# Altium schematic sheet 37.SchDoc
size 513 x 386 mm
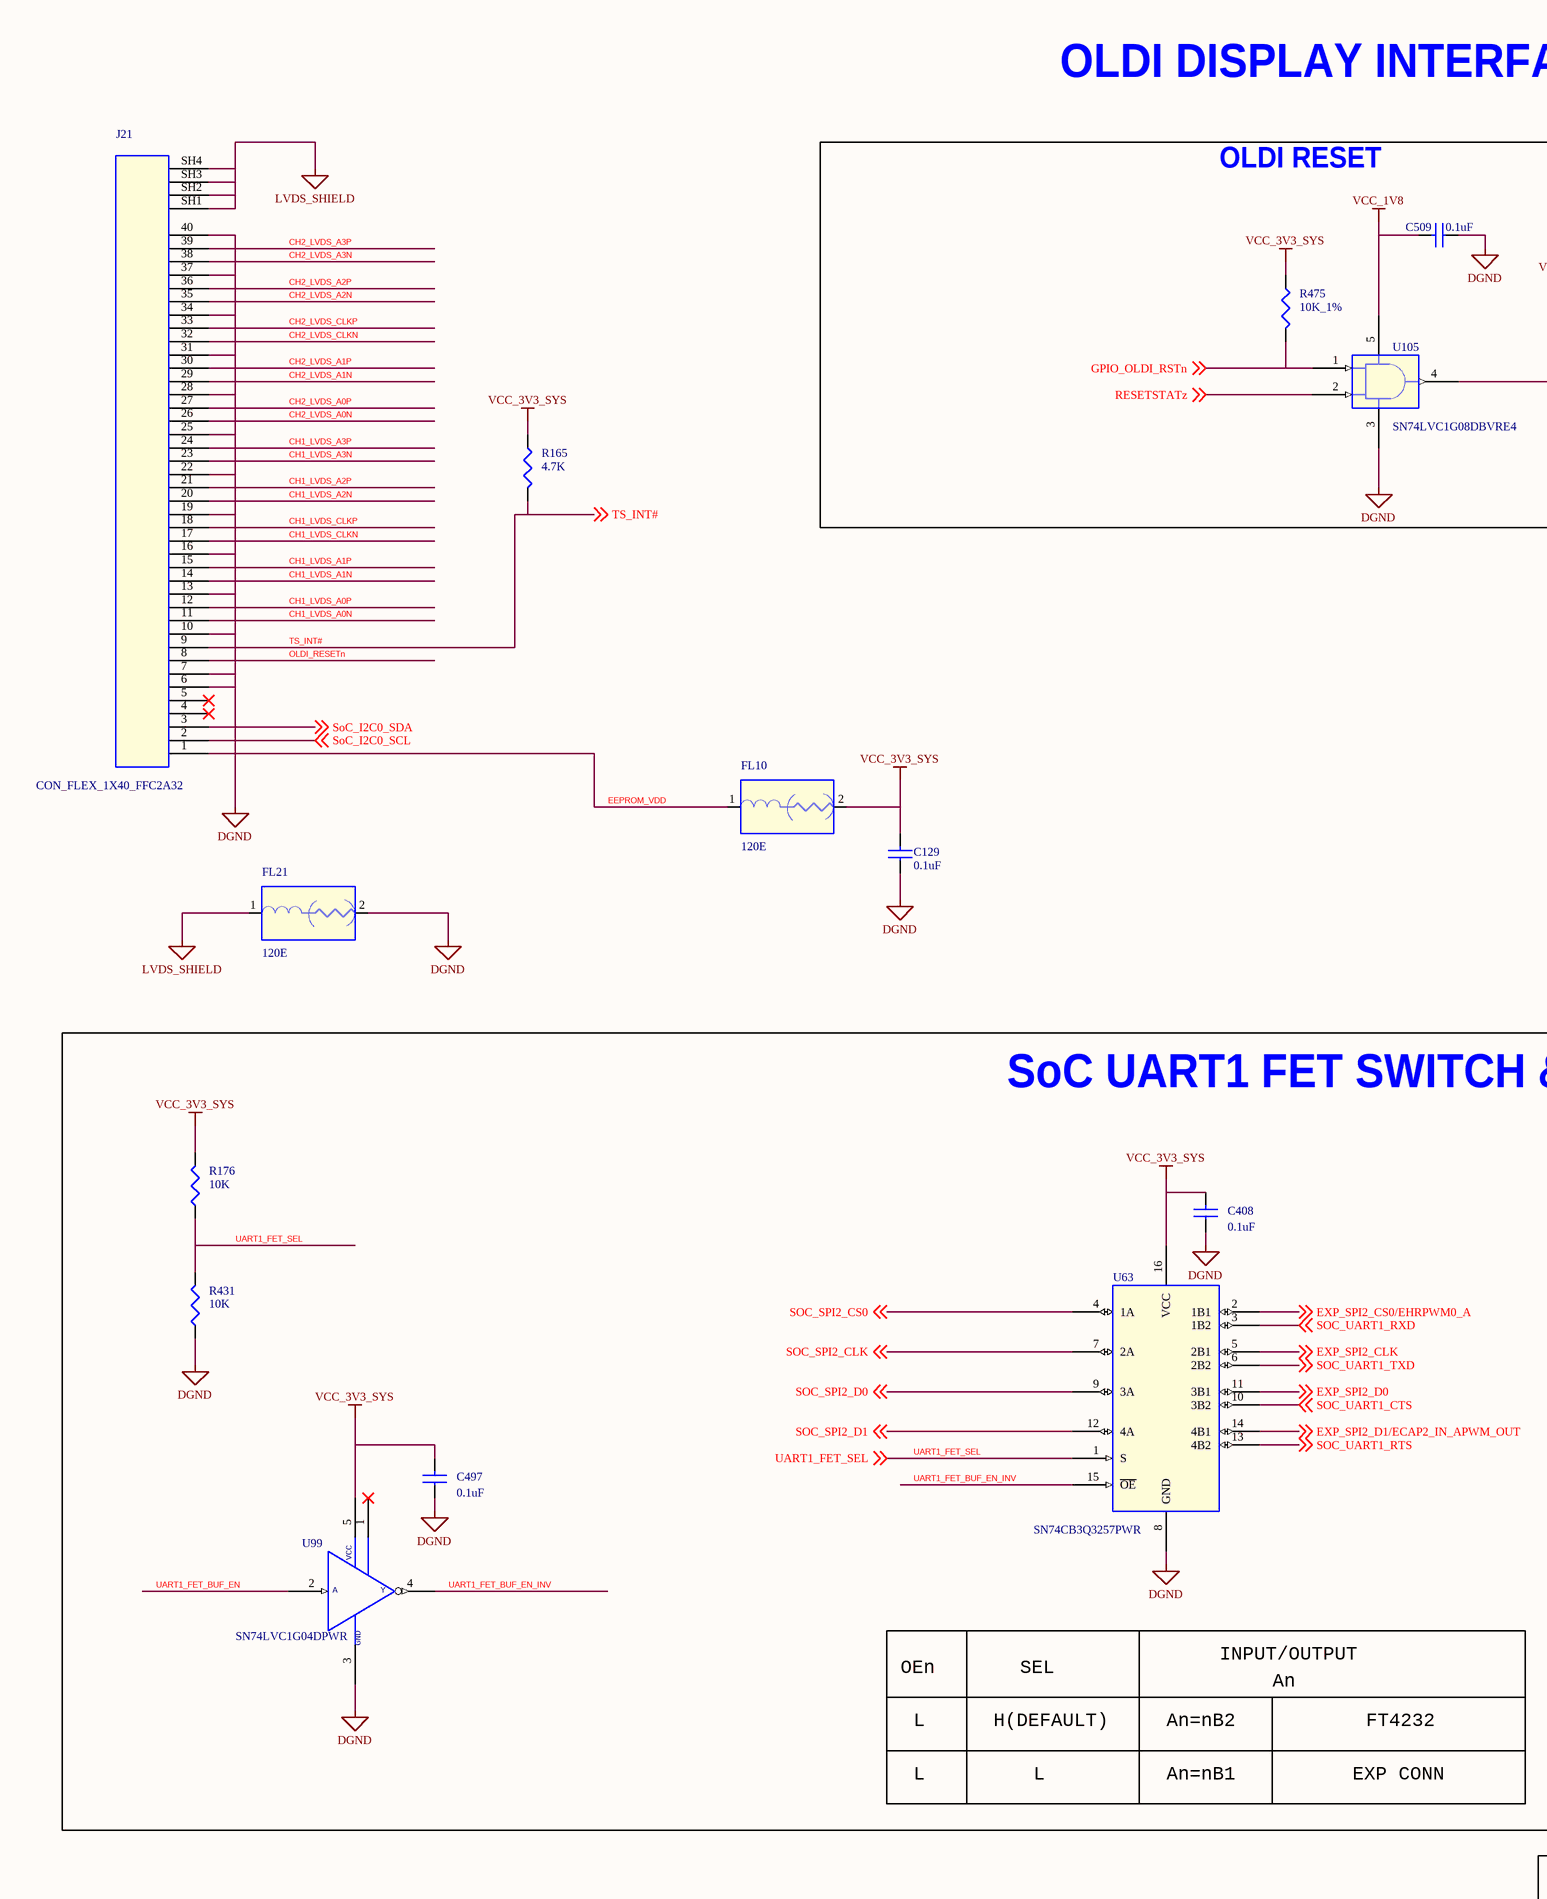
[diagram p0: 37.SchDoc, left]
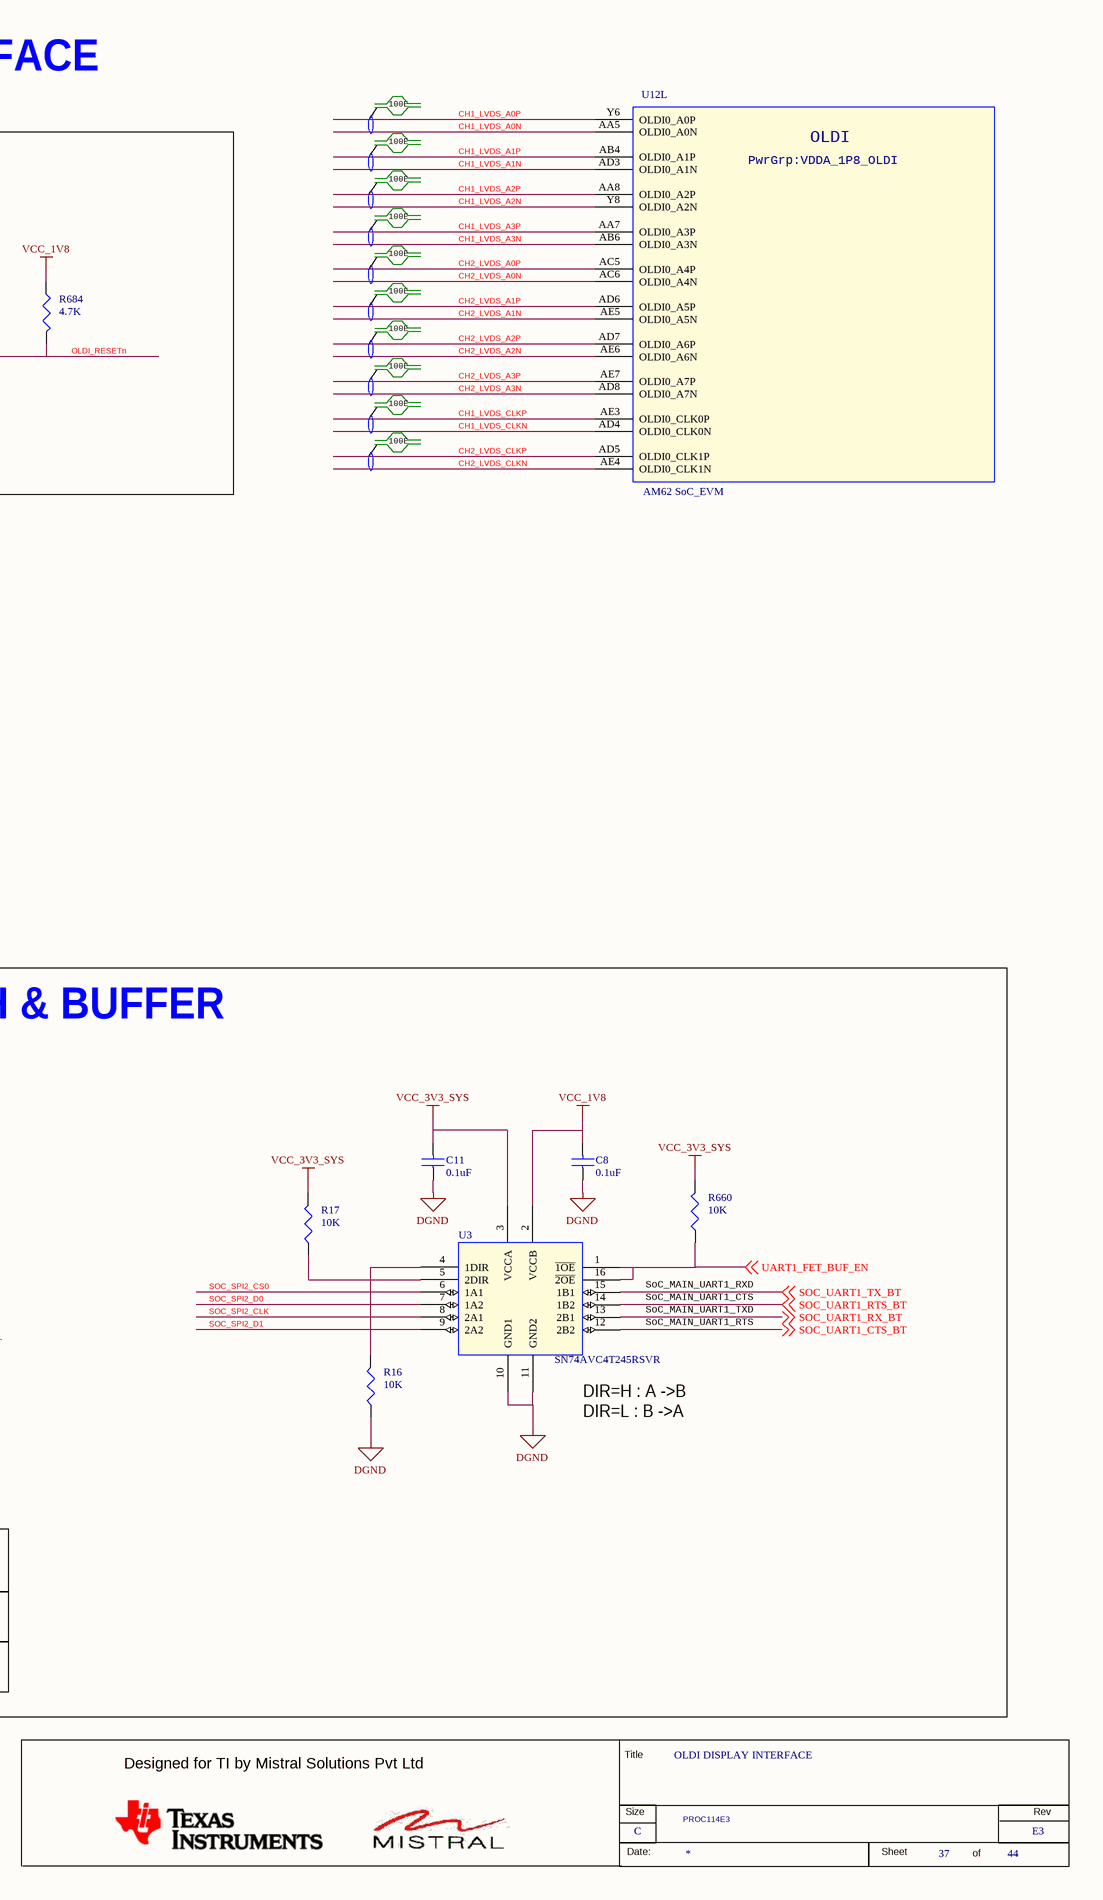
[diagram p1: 37.SchDoc, right]

## Parts
*  RevCode: E3  Title: OLDI DISPLAY INTERFACE  Page Size: C  Page Number: 37  Page Count: 44  Variant Name: PROC114E3  (hidden comment: MISTRAL_TITLEBLK_CSIZE)  (graphical)
C8  0.1uF  [CAP0201_0-5]
C11  0.1uF  [CAP0201_0-5]
C129  0.1uF  [CAP0201_0-5]
C408  0.1uF  [CAP0402_0-75]
C497  0.1uF  [CAP0201_0-5]
C509  0.1uF  [CAP0402_0-75]
FL10  120E  [EMIFIL_BLM15A_0402_0-6]
FL21  120E  [EMIFIL_BLM15A_0402_0-6]
J21  CON_FLEX_1X40_FFC2A32  [CON_FLEX1X40_FFC2A32-40-T_S_S_S_4-3]
R16  10K  [RES0201_0-5]
R17  10K  [RES0201_0-5]
R165  4.7K  [RES0201_0-5]
R176  10K  [RES0201_0-5]
R431  10K  [RES0201_0-5]
R475  10K_1%  [RES0201_0-5]
R660  10K  [RES0201_0-5]
R684  4.7K  [RES0201_0-5]
U3  SN74AVC4T245RSVR  [UQFN16_TMUX1574_70X100_0-6]
U12  AM62 SoC_EVM  [BGA425_19-68_510X510_0-7]  (part L of 18)
U63  SN74CB3Q3257PWR  [TSSOP16_25-59_205X180]
U99  SN74LVC1G04DPWR  [X2SON5_TLV7021_30X30_0-4]
U105  SN74LVC1G08DBVRE4  [SOT23-5]

## Blocks framed on the sheet
OLDI RESET: C509 R475 R684 U105
SoC UART1 FET SWITCH & BUFFER: C8 C11 C408 C497 R16 R17 R176 R431 R660 U3 U63 U99

## Nets
DGND: C8.1 C11.1 C129.1 C408.1 C497.1 C509.1 FL21.2 J21.6 J21.7 J21.10 J21.13 J21.16 J21.19 J21.22 J21.25 J21.28 J21.31 J21.34 J21.37 J21.40 R16.1 R431.1 U3.10(GND1) U3.11(GND2) U63.8(GND) U99.3(GND) U105.3(GND)
LVDS_SHIELD: FL21.1 J21.SH1 J21.SH2 J21.SH3 J21.SH4
VCC_1V8: C8.2 C509.2 R684.1 U3.2(VCCB) U105.5(VCC)
VCC_3V3_SYS: C11.2 C129.2 C408.2 C497.2 FL10.2 R17.2 R165.1 R176.2 R475.1 R660.2 U3.3(VCCA) U63.16(VCC) U99.5(VCC)
CH1_LVDS_A0N: J21.11 U12.AA5(OLDI0_A0N)
CH1_LVDS_A0P: J21.12 U12.Y6(OLDI0_A0P)
CH1_LVDS_A1N: J21.14 U12.AD3(OLDI0_A1N)
CH1_LVDS_A1P: J21.15 U12.AB4(OLDI0_A1P)
CH1_LVDS_A2N: J21.20 U12.Y8(OLDI0_A2N)
CH1_LVDS_A2P: J21.21 U12.AA8(OLDI0_A2P)
CH1_LVDS_A3N: J21.23 U12.AB6(OLDI0_A3N)
CH1_LVDS_A3P: J21.24 U12.AA7(OLDI0_A3P)
CH1_LVDS_CLKN: J21.17 U12.AD4(OLDI0_CLK0N)
CH1_LVDS_CLKP: J21.18 U12.AE3(OLDI0_CLK0P)
CH2_LVDS_A0N: J21.26 U12.AC6(OLDI0_A4N)
CH2_LVDS_A0P: J21.27 U12.AC5(OLDI0_A4P)
CH2_LVDS_A1N: J21.29 U12.AE5(OLDI0_A5N)
CH2_LVDS_A1P: J21.30 U12.AD6(OLDI0_A5P)
CH2_LVDS_A2N: J21.35 U12.AE6(OLDI0_A6N)
CH2_LVDS_A2P: J21.36 U12.AD7(OLDI0_A6P)
CH2_LVDS_A3N: J21.38 U12.AD8(OLDI0_A7N)
CH2_LVDS_A3P: J21.39 U12.AE7(OLDI0_A7P)
CH2_LVDS_CLKN: J21.32 U12.AE4(OLDI0_CLK1N)
CH2_LVDS_CLKP: J21.33 U12.AD5(OLDI0_CLK1P)
EEPROM_VDD: FL10.1 J21.1
EXP_SPI2_CLK: U63.5(2B1) ; off-sheet EXP_SPI2_CLK
EXP_SPI2_CS0/EHRPWM0_A: U63.2(1B1) ; off-sheet EXP_SPI2_CS0/EHRPWM0_A
EXP_SPI2_D0: U63.11(3B1) ; off-sheet EXP_SPI2_D0
EXP_SPI2_D1/ECAP2_IN_APWM_OUT: U63.14(4B1) ; off-sheet EXP_SPI2_D1/ECAP2_IN_APWM_OUT
GPIO_OLDI_RSTn: R475.2 U105.1(A) ; off-sheet GPIO_OLDI_RSTn
OLDI_RESETn: J21.8 R684.2 U105.4(Y)
RESETSTATz: U105.2(B) ; off-sheet RESETSTATz
SoC_I2C0_SCL: J21.2 ; off-sheet SoC_I2C0_SCL
SoC_I2C0_SDA: J21.3 ; off-sheet SoC_I2C0_SDA
SOC_SPI2_CLK: U3.8(2A1) U63.7(2A) ; off-sheet SOC_SPI2_CLK
SOC_SPI2_CS0: U3.6(1A1) U63.4(1A) ; off-sheet SOC_SPI2_CS0
SOC_SPI2_D0: U3.7(1A2) U63.9(3A) ; off-sheet SOC_SPI2_D0
SOC_SPI2_D1: U3.9(2A2) U63.12(4A) ; off-sheet SOC_SPI2_D1
SOC_UART1_CTS: U63.10(3B2) ; off-sheet SOC_UART1_CTS
SOC_UART1_CTS_BT: U3.12(2B2) ; off-sheet SOC_UART1_CTS_BT
SOC_UART1_RTS: U63.13(4B2) ; off-sheet SOC_UART1_RTS
SOC_UART1_RTS_BT: U3.14(1B2) ; off-sheet SOC_UART1_RTS_BT
SOC_UART1_RX_BT: U3.13(2B1) ; off-sheet SOC_UART1_RX_BT
SOC_UART1_RXD: U63.3(1B2) ; off-sheet SOC_UART1_RXD
SOC_UART1_TX_BT: U3.15(1B1) ; off-sheet SOC_UART1_TX_BT
SOC_UART1_TXD: U63.6(2B2) ; off-sheet SOC_UART1_TXD
TS_INT#: J21.9 R165.2 ; off-sheet TS_INT#
UART1_FET_BUF_EN: R660.1 U3.1(~{1OE}) U3.16(~{2OE}) U99.2(A) ; off-sheet UART1_FET_BUF_EN
UART1_FET_BUF_EN_INV: U63.15(~{OE}) U99.4(Y)
UART1_FET_SEL: R176.1 R431.2 U63.1(S) ; off-sheet UART1_FET_SEL
NetR16_2: R16.2 U3.4(1DIR)
NetR17_1: R17.1 U3.5(2DIR)

Not connected (* = marked no-connect by the designer): J21 4* 5*; U99 1(NC)*

## Notes on the sheet
- OLDI DISPLAY INTERFACE
- 100E
- SoC_MAIN_UART1_RXD
- SoC_MAIN_UART1_TXD
- SoC_MAIN_UART1_CTS
- SoC_MAIN_UART1_RTS
- (near U3) DIR=H : A ->B
  DIR=L : B ->A
- OEn
- SEL
- INPUT/OUTPUT
- An
- L
- H(DEFAULT)
- An=nB2
- FT4232
- An=nB1
- EXP CONN
- (in symbol AM62-EVM_BGA425, part L) OLDI; PwrGrp:VDDA_1P8_OLDI
- (in symbol MISTRAL_TITLEBLK_CSIZE) Title; Designed for TI by Mistral Solutions Pvt Ltd; Size; Rev; Date:; Sheet; of

## Library data of the parts
* = MISTRAL_TITLEBLK_CSIZE: Issue: 1.0; Page Create Date: March  8, 1995; Page Modify Date: *; Schematic Page Count: 44; Schematic Page Number: 37
C8 C11 C129 = CAP_Dup2: CAP CERAMIC 0.1uF 16V 10% X5R 0201; Alt_Mfr_name: YAGEO AMERICA; Part_type: CAPACITORS\CERAMIC; Mfr_part_number: GRM033R61C104KE14D; Mfr_name: MURATA; Mistral Part No: 120009030072-R; Alt_Mfr_part_number: CC0402KRX5R8BB104; Custom_Duty: 15%; Customs_HS_Code: 85322990; Wattage: NA; Project: TI_MAXIE_CPB; Footprint Path: Y:\MIS_DATABASE\Library\ALTIUM_TOOL\PCB_FOOTPRINTS\Altium_Footprint_Lib.PcbLib; Library Path: Y:\MIS_DATABASE\Library\ALTIUM_TOOL\SCHEMATICS_PARTS\MS_DISCRETE_Library.schlib; Footprint Ref: CAP0201_0-5; Library Ref: CAP; MECHANICAL 3D STEP FILE: CAP0201_0-5; Chkd/date: MANIRAJA/230118; Crtd /date: MANIRAJA/230118; Datasheet: Y:\MIS_DATABASE\DATASHEETS\CAPACITORS\GRM033R61C104KE14.PDF; Temperature: -55°C+85°C; Weight: 0.33mg; Height: 0.33MM; Distributor_part_number: 490-14305-1-ND; Distributor_name: DIGIKEY; Package: 0201; Voltage: 16V; Tolerance: 10%; PCB Footprint: CAP0201_0-5
C408 C509 = CAP_Dup2: CAP CERAMIC 0.1uF 50V 10% X7R 0402; Alt_Mfr_part_number: CC0402KRX5R8BB104; Mistral Part No: 120011100014-R; Mfr_name: MURATA; Mfr_part_number: GRM155R71H104KE14D; Part_type: CAPACITORS\CERAMIC; Alt_Mfr_name: YAGEO AMERICA; Project: J7_CP; Wattage: NA; Customs_HS_Code: 85322990; Custom_Duty: 15%; Tolerance: 10%; Voltage: 50V; Package: 0402; Distributor_name: DIGIKEY; Distributor_part_number: 490-10700-1-ND; Height: 0.55MM; Weight: 3.1mg; Temperature: -55°C+125°C; Datasheet: Y:\MIS_DATABASE\DATASHEETS\CAPACITORS\GRM155R71H104KE14.PDF; Crtd /date: ALVY/211020; Chkd/date: MANIRAJA/261020; MECHANICAL 3D STEP FILE: CAP0402_0-75; Library Ref: CAP; Footprint Ref: CAP0402_0-75; Library Path: Y:\MIS_DATABASE\Library\ALTIUM_TOOL\SCHEMATICS_PARTS\MS_DISCRETE_Library.schlib; Footprint Path: Y:\MIS_DATABASE\Library\ALTIUM_TOOL\PCB_FOOTPRINTS\Altium_Footprint_Lib.PcbLib; PCB Footprint: CAP0402_0-75
C497 = CAP_Dup2: CAP CERAMIC 0.1uF 16V 10% X5R 0201; Alt_Mfr_part_number: CC0402KRX5R8BB104; Mistral Part No: 120009030072-R; Mfr_name: MURATA; Mfr_part_number: GRM033R61C104KE14D; Part_type: CAPACITORS\CERAMIC; Alt_Mfr_name: YAGEO AMERICA; Project: TI_MAXIE_CPB; Wattage: NA; Customs_HS_Code: 85322990; Custom_Duty: 15%; Tolerance: 10%; Voltage: 16V; Package: 0201; Distributor_name: DIGIKEY; Distributor_part_number: 490-14305-1-ND; Height: 0.33MM; Weight: 0.33mg; Temperature: -55°C+85°C; Datasheet: Y:\MIS_DATABASE\DATASHEETS\CAPACITORS\GRM033R61C104KE14.PDF; Crtd /date: MANIRAJA/230118; Chkd/date: MANIRAJA/230118; MECHANICAL 3D STEP FILE: CAP0201_0-5; Library Ref: CAP; Footprint Ref: CAP0201_0-5; Library Path: Y:\MIS_DATABASE\Library\ALTIUM_TOOL\SCHEMATICS_PARTS\MS_DISCRETE_Library.schlib; Footprint Path: Y:\MIS_DATABASE\Library\ALTIUM_TOOL\PCB_FOOTPRINTS\Altium_Footprint_Lib.PcbLib; PCB Footprint: CAP0201_0-5
FL10 FL21 = EMIFILTER_IND: IND FERRITE BEAD CHIP 120E 2A 0402; Mistral Part No: 130013060022-R; Mfr_name: MURATA; Mfr_part_number: BLM15PX121SN1D; Part_type: INDUCTOR; Project: GEN_3-8; Tolerance: 25%; Voltage: NA; Customs_HS_Code: 85369090; Custom_Duty: 24%; Footprint Ref: EMIFIL_BLM15A_0402_0-6; Wattage: NA; Package: 0402; Distributor_name: DIGIKEY; Distributor_part_number: 490-9656-1-ND; Library Ref: EMIFILTER_IND; Height: 0.55MM; Weight: 1mg; Temperature: -55°C+125°C; Datasheet: Y:\MIS_DATABASE\DATASHEETS\DISCRETES\INDUCTORS\BLM15-SN1-SER.PDF; Crtd /date: USMAN/170613; Chkd/date: NAVEED/241114; MECHANICAL 3D STEP FILE: EMIFIL_BLM15A_0402_0-6; Library Path: Y:\MIS_DATABASE\Library\ALTIUM_TOOL\SCHEMATICS_PARTS\MS_FILTER_Library.schlib; Footprint Path: Y:\MIS_DATABASE\Library\ALTIUM_TOOL\PCB_FOOTPRINTS\Altium_Footprint_Lib.PcbLib; PCB Footprint: EMIFIL_BLM15A_0402_0-6
J21 = CON_FLEX_40X1_SH4: CON FPC 1X40 0.50MM PITCH FEMALE ST SMD; Mistral Part No: 150021100004-R; Mfr_name: GCT; Mfr_part_number: FFC2A32-40-T; Part_type: CONNECTOR\FPC; Project: TI_AM62x SKEVM_BRD; Tolerance: NA; Customs_HS_Code: 85369090; Custom_Duty: 24%; Footprint Path: Y:\MIS_DATABASE\Library\ALTIUM_TOOL\PCB_FOOTPRINTS\Altium_Footprint_Lib.PcbLib; Library Path: Y:\MIS_DATABASE\Library\ALTIUM_TOOL\SCHEMATICS_PARTS\MS_CONNECTOR_Library.schlib; Footprint Ref: CON_FLEX1X40_FFC2A32-40-T_S_S_S_4-3; Voltage: NA; Wattage: NA; Package: SMD; Distributor_name: DIGIKEY; Distributor_part_number: 2073-FFC2A32-40-TCT-ND; Library Ref: CON_FLEX_40X1_SH4; Height: 4.25MM; Weight: 710mg; Temperature: -25°C+85°C; Datasheet: Y:\MIS_DATABASE\DATASHEETS\CONNECTORS\FFC2A32.PDF; Crtd /date: ALVY/041021; Chkd/date: MANIRAJA/061021; MECHANICAL 3D STEP FILE: CON_FLEX1X40_FFC2A32-40-T_S_S_S_4-3; PCB Footprint: CON_FLEX1X40_FFC2A32-40-T_S_S_S_4-3
R16 R17 = RESISTOR_Dup6: RES 10K 1/20W 5% 0201; Part_type: RESISTORS\FIXED; Mfr_part_number: RC0201JR-0710KL; Mfr_name: YAGEO AMERICA; Mistral Part No: 110010070051-R; Custom_Duty: 15%; Customs_HS_Code: 85332119; Voltage: NA; Project: GOLDEN-I LITE; MECHANICAL 3D STEP FILE: RES0201_0-5; Chkd/date: MANIRAJA/050517; Crtd /date: MANIRAJA/050517; Datasheet: Y:\MIS_DATABASE\DATASHEETS\RESISTORS\RCXXXXL-SER_MAR18.PDF; Temperature: -55°C+125°C; Weight: 0.17mg; Height: 0.26MM; Distributor_part_number: 311-10KNCT-ND; Distributor_name: DIGIKEY; Package: 0201; Wattage: 1/20W; Tolerance: 5%; Library Ref: RESISTOR; Footprint Ref: RES0201_0-5; Library Path: Y:\MIS_DATABASE\Library\ALTIUM_TOOL\SCHEMATICS_PARTS\MS_DISCRETE_Library.schlib; Footprint Path: Y:\MIS_DATABASE\Library\ALTIUM_TOOL\PCB_FOOTPRINTS\Altium_Footprint_Lib.PcbLib; PCB Footprint: RES0201_0-5
R165 R684 = RESISTOR_Dup6: RES 4.7K 1/20W 5% 0201; Mistral Part No: 110021090007-R; Mfr_name: YAGEO AMERICA; Mfr_part_number: RC0201JR-074K7L; Part_type: RESISTORS\FIXED; Project: TI_AM62x SKEVM_BRD; Voltage: NA; Customs_HS_Code: 85332119; Custom_Duty: 15%; Footprint Ref: RES0201_0-5; Tolerance: 5%; Wattage: 1/20W; Package: 0201; Distributor_name: DIGIKEY; Distributor_part_number: 311-4.7KNCT-ND; Library Ref: RESISTOR; Height: 0.26MM; Weight: 0.17mg; Temperature: -55°C+125°C; Datasheet: Y:\MIS_DATABASE\DATASHEETS\RESISTORS\RCXXXXL-SER_MAR18.PDF; Crtd /date: ALVY/200921; Chkd/date: MANIRAJA/200921; MECHANICAL 3D STEP FILE: RES0201_0-5; Library Path: Y:\MIS_DATABASE\Library\ALTIUM_TOOL\SCHEMATICS_PARTS\MS_DISCRETE_Library.schlib; Footprint Path: Y:\MIS_DATABASE\Library\ALTIUM_TOOL\PCB_FOOTPRINTS\Altium_Footprint_Lib.PcbLib; PCB Footprint: RES0201_0-5
R176 R431 R660 = RESISTOR_Dup6: RES 10K 1/20W 5% 0201; Mistral Part No: 110010070051-R; Mfr_name: YAGEO AMERICA; Mfr_part_number: RC0201JR-0710KL; Part_type: RESISTORS\FIXED; Project: GOLDEN-I LITE; Voltage: NA; Customs_HS_Code: 85332119; Custom_Duty: 15%; Footprint Ref: RES0201_0-5; Tolerance: 5%; Wattage: 1/20W; Package: 0201; Distributor_name: DIGIKEY; Distributor_part_number: 311-10KNCT-ND; Library Ref: RESISTOR; Height: 0.26MM; Weight: 0.17mg; Temperature: -55°C+125°C; Datasheet: Y:\MIS_DATABASE\DATASHEETS\RESISTORS\RCXXXXL-SER_MAR18.PDF; Crtd /date: MANIRAJA/050517; Chkd/date: MANIRAJA/050517; MECHANICAL 3D STEP FILE: RES0201_0-5; Library Path: Y:\MIS_DATABASE\Library\ALTIUM_TOOL\SCHEMATICS_PARTS\MS_DISCRETE_Library.schlib; Footprint Path: Y:\MIS_DATABASE\Library\ALTIUM_TOOL\PCB_FOOTPRINTS\Altium_Footprint_Lib.PcbLib; PCB Footprint: RES0201_0-5
R475 = RESISTOR_Dup6: RES 10K 1/20W 1% 0201; Part_type: RESISTORS\FIXED; Mfr_part_number: RC0201FR-0710KL; Mfr_name: YAGEO AMERICA; Mistral Part No: 110011040018-R; Custom_Duty: 15%; Customs_HS_Code: 85332119; Voltage: NA; Project: GOLDEN-I LITE; Footprint Path: Y:\MIS_DATABASE\Library\ALTIUM_TOOL\PCB_FOOTPRINTS\Altium_Footprint_Lib.PcbLib; Library Path: Y:\MIS_DATABASE\Library\ALTIUM_TOOL\SCHEMATICS_PARTS\MS_DISCRETE_Library.schlib; MECHANICAL 3D STEP FILE: RES0201_0-5; Chkd/date: VASANTHA/270117; Crtd /date: MANIRAJA/270117; Datasheet: Y:\MIS_DATABASE\DATASHEETS\RESISTORS\RCXXXXL-SER_MAR18.PDF; Temperature: -55°C+125°C; Weight: 0.17mg; Height: 0.26MM; Library Ref: RESISTOR; Distributor_part_number: 311-10.0KMCT-ND; Distributor_name: DIGIKEY; Package: 0201; Wattage: 1/20W; Tolerance: 1%; Footprint Ref: RES0201_0-5; PCB Footprint: RES0201_0-5
U3 = SN74AVC4T245RSV_UQFN16: IC 2-BIT BUS TRANSCEIVER WITH CONFIGURABLE VOLTAGE TRANSLATION AND 3 STATE O/P UQFN16; Mistral Part No: 141011040011-R; Mfr_name: TEXAS INSTRUMENTS; Part_type: ICS\DIGITAL\BUSTRANSCEIVER; Project: HMC; Tolerance: NA; Customs_HS_Code: 85423100; Custom_Duty: 15%; Footprint Ref: UQFN16_TMUX1574_70X100_0-6; Mfr_part_number: SN74AVC4T245RSVR; Voltage: NA; Wattage: NA; Package: UQFN16; Distributor_name: DIGIKEY; Distributor_part_number: 296-24366-1-ND; Library Ref: SN74AVC4T245RSV_UQFN16; Height: 0.55MM; Weight: 41mg; Temperature: -40°C+85°C; Datasheet: Y:\MIS_DATABASE\DATASHEETS\ICS\DIGITAL\BUSTRANSCEIVER\SN74AVC4T245-SER.PDF; Crtd /date: BAVISH/190411; Chkd/date: MANIRAJA/040520; MECHANICAL 3D STEP FILE: UQFN16_TMUX1574_70X100_0-6; Library Path: Y:\MIS_DATABASE\Library\ALTIUM_TOOL\SCHEMATICS_PARTS\MS_BUSDRIVERTRANSCEIVER_Library.schlib; Footprint Path: Y:\MIS_DATABASE\Library\ALTIUM_TOOL\PCB_FOOTPRINTS\Altium_Footprint_Lib.PcbLib; PCB Footprint: UQFN16_TMUX1574_70X100_0-6
U12 = AM62-EVM_BGA425: IC AM62 SoC MICROPROCESSOR BGA425; Mistral Part No: 141221060001; Mfr_name: TEXAS INSTRUMENTS; Part_type: ICS\DIGITAL\MICROPROCESSOR; Project: AM62_EVM_BRD; Tolerance: NA; Customs_HS_Code: 85423100; Custom_Duty: 15%; Mfr_part_number: AM62 SoC_EVM; Voltage: NA; Wattage: NA; Package: BGA425; Distributor_name: NA; Distributor_part_number: NA; Library Ref: AM62-EVM_BGA425; Footprint Ref: BGA425_19-68_510X510_0-7; Height: 0.65MM; Weight: NA; Temperature: NA; Datasheet: Y:\MIS_DATABASE\DATASHEETS\ICS\DIGITAL\MICROCONTROLLER\AM62-SoC_SVB.PDF; Crtd /date: MANIRAJA/110621; Chkd/date: ALVY/110621; RoHS: NA; MECHANICAL 3D STEP FILE: BGA425_19-68_510X510_0-7; Library Path: Y:\MIS_DATABASE\Library\ALTIUM_TOOL\SCHEMATICS_PARTS\MS_MICROPROCESSOR_Library.schlib; Footprint Path: Y:\MIS_DATABASE\Library\ALTIUM_TOOL\PCB_FOOTPRINTS\Altium_Footprint_Lib.PcbLib; PCB Footprint: BGA425_19-68_510X510_0-7
U63 = SN74CB3Q3257PWR_TSSOP16: IC 4BIT 1-OF-2 FET MULTIPLEXER/DEMULTIPLEXER TSSOP16; Mistral Part No: 141009030117-R; Mfr_name: TEXAS INSTRUMENTS; Part_type: ICS\DIGITAL\COMBINATIONAL; Project: OMAP_EVM; Customs_HS_Code: 85423100; Custom_Duty: 15%; Mfr_part_number: SN74CB3Q3257PWR; Package: TSSOP16; Distributor_name: DIGIKEY; Distributor_part_number: 296-19138-1-ND; Library Ref: SN74CB3Q3257PWR_TSSOP16; Height: 1.20MM; Temperature: -40°C+85°C; Datasheet: Y:\MIS_DATABASE\DATASHEETS\ICS\DIGITAL\COMBINATIONAL\SN74CB3Q3257.PDF; Crtd /date: USMAN/060109; Chkd/date: SUHAS/251010; RoHS: Sb/ Br FREE; PCB Footprint: TSSOP16_25-59_205X180
U99 = SN74LVC1G04DCKR_SC70-5: IC SINGLE INVERTER GATE X2SON5; Mistral Part No: 141020100010-R; Mfr_name: TEXAS INSTRUMENTS; Part_type: ICS\DIGITAL\GATES; Project: AM64X_SKEVM; Tolerance: NA; Customs_HS_Code: 85423100; Custom_Duty: 15%; Footprint Ref: X2SON5_TLV7021_30X30_0-4; Mfr_part_number: SN74LVC1G04DPWR; Voltage: NA; Wattage: NA; Package: X2SON5; Distributor_name: DIGIKEY; Distributor_part_number: 296-37758-1-ND; Library Ref: SN74LVC1G04DCKR_SC70-5; Height: 0.40MM; Weight: 0.6mg; Temperature: -40°C+125°C; Datasheet: Y:\MIS_DATABASE\DATASHEETS\ICS\DIGITAL\GATES\SN74LVC1G04XX.PDF; Crtd /date: ALVY/131020; Chkd/date: MANIRAJA/141020; MECHANICAL 3D STEP FILE: X2SON5_TLV7021_30X30_0-4; Library Path: Y:\MIS_DATABASE\Library\ALTIUM_TOOL\SCHEMATICS_PARTS\MS_GATE_Library.schlib; Footprint Path: Y:\MIS_DATABASE\Library\ALTIUM_TOOL\PCB_FOOTPRINTS\Altium_Footprint_Lib.PcbLib; PCB Footprint: X2SON5_TLV7021_30X30_0-4
U105 = SN74LVC1G08DBVRE4_SOT23-5_Dup1: IC SINGLE 2-INPUT POSITIVE AND GATE SOT23-5; Part_type: ICS\DIGITAL\GATES; Mfr_name: TEXAS INSTRUMENTS; Mistral Part No: 141009060026-R; Custom_Duty: 15%; Customs_HS_Code: 85423100; Project: KHAN_MAIN; RoHS: Sb/ Br FREE; Chkd/date: SUHAS/221010; Crtd /date: USMAN/151008; Datasheet: Y:\MIS_DATABASE\DATASHEETS\ICS\DIGITAL\GATES\SN74LVC1G08.PDF; Temperature: -40°C+85°C; Height: 1.45MM; Library Ref: SN74LVC1G08DBVRE4_SOT23-5; Distributor_part_number: SN74LVC1G08DBVRE4-ND; Distributor_name: DIGIKEY; Package: SOT23-5; Mfr_part_number: SN74LVC1G08DBVRE4; PCB Footprint: SOT23-5